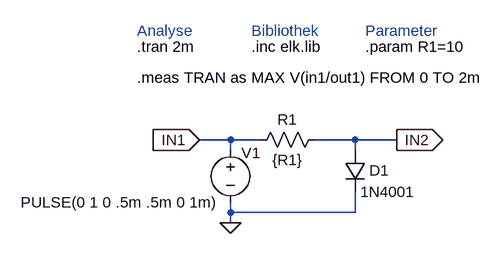
[diagram p0: schematic Draft_Diode_1N4001.asc]
Draft_Diode_1N4001.asc, the LTspice schematic file:
Version 4
SHEET 1 880 680
WIRE 48 80 0 80
WIRE 96 80 48 80
WIRE 240 80 176 80
WIRE 304 80 240 80
WIRE 48 96 48 80
WIRE 240 96 240 80
WIRE 48 192 48 176
WIRE 240 192 240 160
WIRE 240 192 48 192
WIRE 48 208 48 192
FLAG 48 208 0
FLAG 0 80 IN1
IOPIN 0 80 In
FLAG 304 80 IN2
IOPIN 304 80 Out
SYMBOL res 80 96 R270
WINDOW 0 32 56 VTop 2
WINDOW 3 1 56 VBottom 2
SYMATTR InstName R1
SYMATTR Value {R1}
SYMBOL diode 224 96 R0
WINDOW 0 38 31 Left 2
SYMATTR InstName D1
SYMATTR Value 1N4001
SYMBOL voltage 48 80 R0
WINDOW 3 -323 96 Left 2
WINDOW 123 0 0 Left 0
WINDOW 39 0 0 Left 0
WINDOW 0 17 20 Left 2
SYMATTR Value PULSE(0 1 0 .5m .5m 0 1m)
SYMATTR InstName V1
TEXT -96 -64 Left 2 !.tran 2m
TEXT 80 -64 Left 2 !.inc elk.lib
TEXT -96 -16 Left 2 !.meas TRAN as MAX V(in1/out1) FROM 0 TO 2m
TEXT 256 -64 Left 2 !.param R1=10
TEXT -96 -88 Left 2 ;Analyse
TEXT 80 -88 Left 2 ;Bibliothek
TEXT 256 -88 Left 2 ;Parameter

The netlist it stands for:
* Draft_Diode_1N4001.asc
R1 IN1 IN2 {R1}
D1 IN2 0 1N4001
V1 IN1 0 PULSE(0 1 0 .5m .5m 0 1m)
.model D D
.lib standard.dio
.tran 2m
.inc elk.lib
.meas TRAN as MAX V(in1/out1) FROM 0 TO 2m
.param R1=10
* Analyse
* Bibliothek
* Parameter
.backanno
.end

* Results of the author's LTspice run, read from the files saved beside the schematic
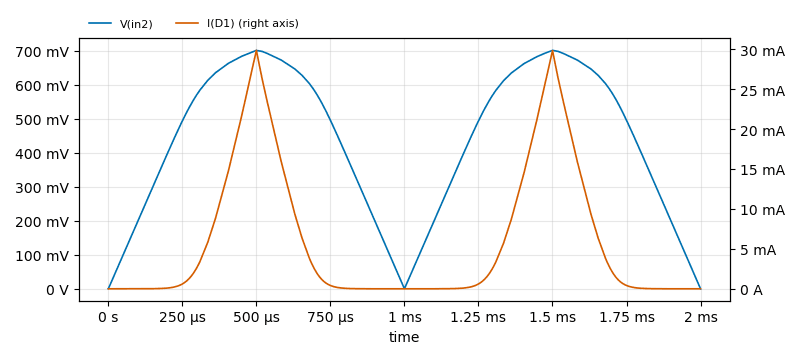
[diagram p1: Transient Analysis of Draft_Diode_1N4001.asc, plotted from the saved traces]
* Transient Analysis, 1 run:
*   V(in2): min 0 V, max 701.6 mV, average 440.3 mV, rms 492.3 mV, last 758.3 nV
*   I(D1): min -75.83 nA, max 29.85 mA, average 5.969 mA, rms 10.62 mA, last -75.83 nA
* From the log:
*   Measurement "as" FAIL'ed